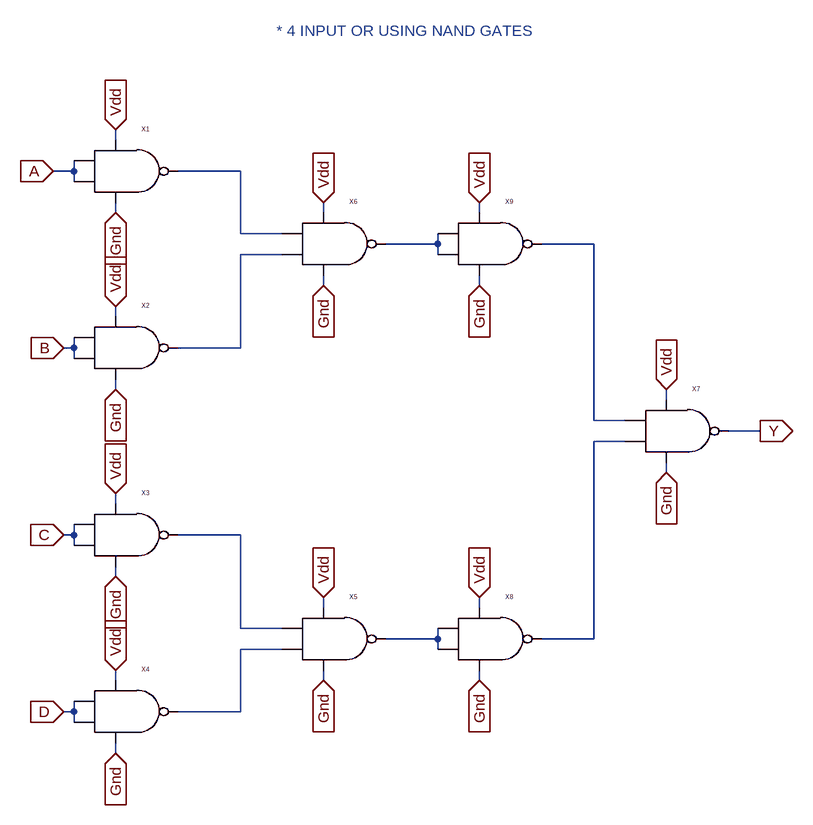
[diagram p0: schematic 4or.asc]
4or.asc, the LTspice schematic file:
Version 4
SHEET 1 1276 984
WIRE -80 -64 -80 -80
WIRE -144 -16 -144 -32
WIRE -144 -16 -176 -16
WIRE 112 -16 16 -16
WIRE -144 0 -144 -16
WIRE -80 48 -80 32
WIRE 240 48 240 32
WIRE 480 48 480 32
WIRE 112 80 112 -16
WIRE 176 80 112 80
WIRE 416 96 416 80
WIRE 416 96 336 96
WIRE 656 96 576 96
WIRE 176 112 112 112
WIRE 416 112 416 96
WIRE 240 160 240 144
WIRE 480 160 480 144
WIRE -80 208 -80 192
WIRE -144 256 -144 240
WIRE -144 256 -160 256
WIRE 112 256 112 112
WIRE 112 256 16 256
WIRE -144 272 -144 256
WIRE -80 320 -80 304
WIRE 768 336 768 320
WIRE 656 368 656 96
WIRE 704 368 656 368
WIRE 912 384 864 384
WIRE 704 400 656 400
WIRE 768 448 768 432
WIRE -80 496 -80 480
WIRE -144 544 -144 528
WIRE -144 544 -160 544
WIRE 112 544 16 544
WIRE -144 560 -144 544
WIRE -80 608 -80 592
WIRE 656 704 656 400
WIRE 240 656 240 640
WIRE 480 656 480 640
WIRE 112 688 112 544
WIRE 176 688 112 688
WIRE 416 704 416 688
WIRE 416 704 336 704
WIRE 656 704 576 704
WIRE 176 720 112 720
WIRE 416 720 416 704
WIRE -80 768 -80 752
WIRE 240 768 240 752
WIRE 480 768 480 752
WIRE -144 816 -144 800
WIRE -144 816 -160 816
WIRE 112 816 112 720
WIRE 112 816 16 816
WIRE -144 832 -144 816
WIRE -80 880 -80 864
FLAG -176 -16 A
IOPIN -176 -16 In
FLAG -160 256 B
IOPIN -160 256 In
FLAG -160 544 C
IOPIN -160 544 In
FLAG -160 816 D
IOPIN -160 816 In
FLAG -80 -80 Vdd
IOPIN -80 -80 In
FLAG -80 192 Vdd
IOPIN -80 192 In
FLAG -80 480 Vdd
IOPIN -80 480 In
FLAG -80 752 Vdd
IOPIN -80 752 In
FLAG 240 640 Vdd
IOPIN 240 640 In
FLAG 240 32 Vdd
IOPIN 240 32 In
FLAG 768 320 Vdd
IOPIN 768 320 In
FLAG 480 640 Vdd
IOPIN 480 640 In
FLAG 912 384 Y
IOPIN 912 384 Out
FLAG 480 32 Vdd
IOPIN 480 32 In
FLAG 480 160 Gnd
IOPIN 480 160 In
FLAG 768 448 Gnd
IOPIN 768 448 In
FLAG 480 768 Gnd
IOPIN 480 768 In
FLAG 240 768 Gnd
IOPIN 240 768 In
FLAG 240 160 Gnd
IOPIN 240 160 In
FLAG -80 48 Gnd
IOPIN -80 48 In
FLAG -80 608 Gnd
IOPIN -80 608 In
FLAG -80 880 Gnd
IOPIN -80 880 In
FLAG -80 320 Gnd
IOPIN -80 320 In
SYMBOL nand -80 -16 R0
SYMATTR InstName X1
SYMBOL nand -80 256 R0
SYMATTR InstName X2
SYMBOL nand -80 544 R0
SYMATTR InstName X3
SYMBOL nand -80 816 R0
SYMATTR InstName X4
SYMBOL nand 240 704 R0
SYMATTR InstName X5
SYMBOL nand 240 96 R0
SYMATTR InstName X6
SYMBOL nand 768 384 R0
SYMATTR InstName X7
SYMBOL nand 480 704 R0
SYMATTR InstName X8
SYMBOL nand 480 96 R0
SYMATTR InstName X9
TEXT 168 -232 Left 2 ;* 4 INPUT OR USING NAND GATES

The netlist it stands for:
* 4or.asc
XX1 A A Vdd Gnd N001 nand  ; pins A B vdd gnd Y
XX2 B B Vdd Gnd N004 nand  ; pins A B vdd gnd Y
XX3 C C Vdd Gnd N006 nand  ; pins A B vdd gnd Y
XX4 D D Vdd Gnd N008 nand  ; pins A B vdd gnd Y
XX5 N006 N008 Vdd Gnd N007 nand  ; pins A B vdd gnd Y
XX6 N001 N004 Vdd Gnd N002 nand  ; pins A B vdd gnd Y
XX7 N003 N005 Vdd Gnd Y nand  ; pins A B vdd gnd Y
XX8 N007 N007 Vdd Gnd N005 nand  ; pins A B vdd gnd Y
XX9 N002 N002 Vdd Gnd N003 nand  ; pins A B vdd gnd Y
* * 4 INPUT OR USING NAND GATES
.backanno
.end